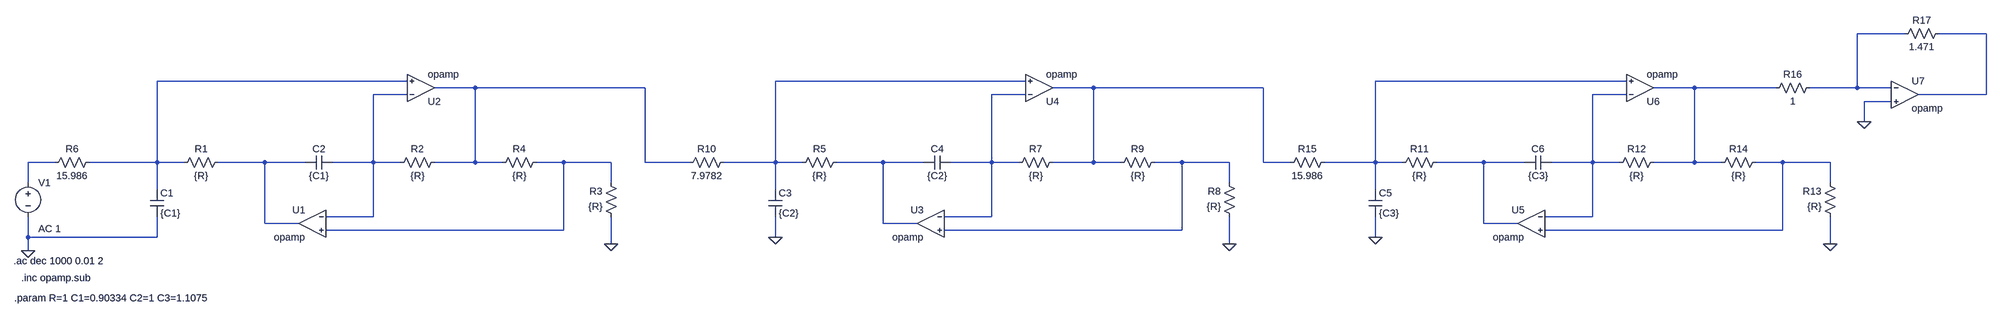
[diagram p0: schematic pasabanda_GIC_norm.asc]
pasabanda_GIC_norm.asc, the LTspice schematic file:
Version 4
SHEET 1 4388 680
WIRE 4192 -48 4080 -48
WIRE 4384 -48 4272 -48
WIRE 384 64 -304 64
WIRE 1984 64 1296 64
WIRE 3536 64 2848 64
WIRE 544 80 448 80
WIRE 944 80 544 80
WIRE 2144 80 2048 80
WIRE 2544 80 2144 80
WIRE 3696 80 3600 80
WIRE 3888 80 3696 80
WIRE 4080 80 4080 -48
WIRE 4080 80 3968 80
WIRE 4160 80 4080 80
WIRE 384 96 304 96
WIRE 1984 96 1904 96
WIRE 3536 96 3456 96
WIRE 4384 96 4384 -48
WIRE 4384 96 4224 96
WIRE 4160 112 4096 112
WIRE 4096 160 4096 112
WIRE -544 256 -608 256
WIRE -304 256 -304 64
WIRE -304 256 -464 256
WIRE -240 256 -304 256
WIRE 48 256 -160 256
WIRE 144 256 48 256
WIRE 304 256 304 96
WIRE 304 256 208 256
WIRE 368 256 304 256
WIRE 544 256 544 80
WIRE 544 256 448 256
WIRE 608 256 544 256
WIRE 752 256 688 256
WIRE 864 256 752 256
WIRE 944 256 944 80
WIRE 1056 256 944 256
WIRE 1296 256 1296 64
WIRE 1296 256 1136 256
WIRE 1360 256 1296 256
WIRE 1648 256 1440 256
WIRE 1744 256 1648 256
WIRE 1904 256 1904 96
WIRE 1904 256 1808 256
WIRE 1968 256 1904 256
WIRE 2144 256 2144 80
WIRE 2144 256 2048 256
WIRE 2208 256 2144 256
WIRE 2352 256 2288 256
WIRE 2464 256 2352 256
WIRE 2544 256 2544 80
WIRE 2608 256 2544 256
WIRE 2848 256 2848 64
WIRE 2848 256 2688 256
WIRE 2912 256 2848 256
WIRE 3200 256 2992 256
WIRE 3296 256 3200 256
WIRE 3456 256 3456 96
WIRE 3456 256 3360 256
WIRE 3520 256 3456 256
WIRE 3696 256 3696 80
WIRE 3696 256 3600 256
WIRE 3760 256 3696 256
WIRE 3904 256 3840 256
WIRE 4016 256 3904 256
WIRE -608 304 -608 256
WIRE 864 304 864 256
WIRE 2464 304 2464 256
WIRE 4016 304 4016 256
WIRE -304 320 -304 256
WIRE 1296 320 1296 256
WIRE 2848 320 2848 256
WIRE 304 384 304 256
WIRE 304 384 192 384
WIRE 1904 384 1904 256
WIRE 1904 384 1792 384
WIRE 3456 384 3456 256
WIRE 3456 384 3344 384
WIRE 48 400 48 256
WIRE 128 400 48 400
WIRE 1648 400 1648 256
WIRE 1728 400 1648 400
WIRE 3200 400 3200 256
WIRE 3280 400 3200 400
WIRE 752 416 752 256
WIRE 752 416 192 416
WIRE 2352 416 2352 256
WIRE 2352 416 1792 416
WIRE 3904 416 3904 256
WIRE 3904 416 3344 416
WIRE -608 432 -608 384
WIRE -304 432 -304 384
WIRE -304 432 -608 432
WIRE 1296 432 1296 384
WIRE 2848 432 2848 384
WIRE 864 448 864 384
WIRE 2464 448 2464 384
WIRE 4016 448 4016 384
WIRE -608 464 -608 432
FLAG 864 448 0
FLAG -608 464 0
FLAG 2464 448 0
FLAG 1296 432 0
FLAG 4016 448 0
FLAG 2848 432 0
FLAG 4096 160 0
SYMBOL res -144 240 R90
WINDOW 0 0 56 VBottom 2
WINDOW 3 32 56 VTop 2
SYMATTR InstName R1
SYMATTR Value {R}
SYMBOL res 464 240 R90
WINDOW 0 0 56 VBottom 2
WINDOW 3 32 56 VTop 2
SYMATTR InstName R2
SYMATTR Value {R}
SYMBOL res 880 400 R180
WINDOW 0 36 76 Left 2
WINDOW 3 36 40 Left 2
SYMATTR InstName R3
SYMATTR Value {R}
SYMBOL OpAmps\\opamp 160 336 M0
SYMATTR InstName U1
SYMBOL OpAmps\\opamp 416 144 M180
SYMATTR InstName U2
SYMBOL res 704 240 R90
WINDOW 0 0 56 VBottom 2
WINDOW 3 32 56 VTop 2
SYMATTR InstName R4
SYMATTR Value {R}
SYMBOL voltage -608 288 R0
WINDOW 123 24 124 Left 2
WINDOW 39 0 0 Left 0
SYMATTR InstName V1
SYMATTR Value ""
SYMATTR Value2 AC 1
SYMBOL res -448 240 R90
WINDOW 0 0 56 VBottom 2
WINDOW 3 32 56 VTop 2
SYMATTR InstName R6
SYMATTR Value 15.986
SYMBOL cap -320 320 R0
SYMATTR InstName C1
SYMATTR Value {C1}
SYMBOL cap 208 240 R90
WINDOW 0 0 32 VBottom 2
WINDOW 3 32 32 VTop 2
SYMATTR InstName C2
SYMATTR Value {C1}
SYMBOL res 1456 240 R90
WINDOW 0 0 56 VBottom 2
WINDOW 3 32 56 VTop 2
SYMATTR InstName R5
SYMATTR Value {R}
SYMBOL res 2064 240 R90
WINDOW 0 0 56 VBottom 2
WINDOW 3 32 56 VTop 2
SYMATTR InstName R7
SYMATTR Value {R}
SYMBOL res 2480 400 R180
WINDOW 0 36 76 Left 2
WINDOW 3 36 40 Left 2
SYMATTR InstName R8
SYMATTR Value {R}
SYMBOL OpAmps\\opamp 1760 336 M0
SYMATTR InstName U3
SYMBOL OpAmps\\opamp 2016 144 M180
SYMATTR InstName U4
SYMBOL res 2304 240 R90
WINDOW 0 0 56 VBottom 2
WINDOW 3 32 56 VTop 2
SYMATTR InstName R9
SYMATTR Value {R}
SYMBOL res 1152 240 R90
WINDOW 0 0 56 VBottom 2
WINDOW 3 32 56 VTop 2
SYMATTR InstName R10
SYMATTR Value 7.9782
SYMBOL cap 1280 320 R0
SYMATTR InstName C3
SYMATTR Value {C2}
SYMBOL cap 1808 240 R90
WINDOW 0 0 32 VBottom 2
WINDOW 3 32 32 VTop 2
SYMATTR InstName C4
SYMATTR Value {C2}
SYMBOL res 3008 240 R90
WINDOW 0 0 56 VBottom 2
WINDOW 3 32 56 VTop 2
SYMATTR InstName R11
SYMATTR Value {R}
SYMBOL res 3616 240 R90
WINDOW 0 0 56 VBottom 2
WINDOW 3 32 56 VTop 2
SYMATTR InstName R12
SYMATTR Value {R}
SYMBOL res 4032 400 R180
WINDOW 0 36 76 Left 2
WINDOW 3 36 40 Left 2
SYMATTR InstName R13
SYMATTR Value {R}
SYMBOL OpAmps\\opamp 3312 336 M0
SYMATTR InstName U5
SYMBOL OpAmps\\opamp 3568 144 M180
SYMATTR InstName U6
SYMBOL res 3856 240 R90
WINDOW 0 0 56 VBottom 2
WINDOW 3 32 56 VTop 2
SYMATTR InstName R14
SYMATTR Value {R}
SYMBOL res 2704 240 R90
WINDOW 0 0 56 VBottom 2
WINDOW 3 32 56 VTop 2
SYMATTR InstName R15
SYMATTR Value 15.986
SYMBOL cap 2832 320 R0
SYMATTR InstName C5
SYMATTR Value {C3}
SYMBOL cap 3360 240 R90
WINDOW 0 0 32 VBottom 2
WINDOW 3 32 32 VTop 2
SYMATTR InstName C6
SYMATTR Value {C3}
SYMBOL OpAmps\\opamp 4192 32 R0
SYMATTR InstName U7
SYMBOL res 3984 64 R90
WINDOW 0 0 56 VBottom 2
WINDOW 3 32 56 VTop 2
SYMATTR InstName R16
SYMATTR Value 1
SYMBOL res 4288 -64 R90
WINDOW 0 0 56 VBottom 2
WINDOW 3 32 56 VTop 2
SYMATTR InstName R17
SYMATTR Value 1.471
TEXT -642 488 Left 2 !.ac dec 1000 0.01 2
TEXT -624 528 Left 2 !.inc opamp.sub
TEXT -640 576 Left 2 !.param R=1 C1=0.90334 C2=1 C3=1.1075

The netlist it stands for:
* pasabanda_GIC_norm.asc
R1 N013 N003 {R}
R2 N006 N009 {R}
R3 0 N014 {R}
XU1 N009 N014 N013 opamp Aol=100K GBW=10Meg  ; pins invin noninvin out
XU2 N009 N003 N006 opamp Aol=100K GBW=10Meg  ; pins invin noninvin out
R4 N014 N006 {R}
V1 N012 0 AC 1
R6 N003 N012 15.986
C1 N003 0 {C1}
C2 N009 N013 {C1}
R5 N015 N004 {R}
R7 N007 N010 {R}
R8 0 N016 {R}
XU3 N010 N016 N015 opamp Aol=100K GBW=10Meg  ; pins invin noninvin out
XU4 N010 N004 N007 opamp Aol=100K GBW=10Meg  ; pins invin noninvin out
R9 N016 N007 {R}
R10 N004 N006 7.9782
C3 N004 0 {C2}
C4 N010 N015 {C2}
R11 N017 N005 {R}
R12 N008 N011 {R}
R13 0 N018 {R}
XU5 N011 N018 N017 opamp Aol=100K GBW=10Meg  ; pins invin noninvin out
XU6 N011 N005 N008 opamp Aol=100K GBW=10Meg  ; pins invin noninvin out
R14 N018 N008 {R}
R15 N005 N007 15.986
C5 N005 0 {C3}
C6 N011 N017 {C3}
XU7 N001 0 N002 opamp Aol=100K GBW=10Meg  ; pins invin noninvin out
R16 N001 N008 1
R17 N002 N001 1.471
.ac dec 1000 0.01 2
.inc opamp.sub
.param R=1 C1=0.90334 C2=1 C3=1.1075
.backanno
.end